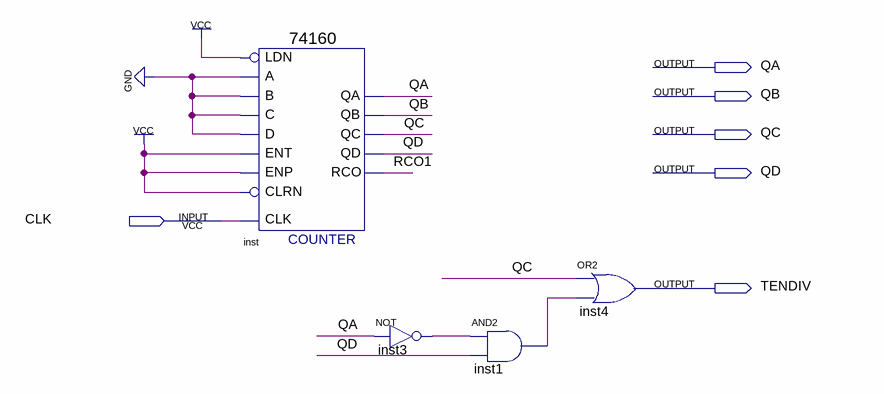
[diagram p0: schematic sheet]
// Quartus schematic 10FENPING.bdf as structural Verilog: 4 symbols, 6 pins
module \10FENPING  (
  input  CLK,
  output QA,
  output QB,
  output QC,
  output QD,
  output TENDIV
);

  wire inst1_out, inst3_out, RCO1;

  \74160  inst (
    .CLK(CLK), .ENT(1'b1), .A(1'b0), .B(1'b0), .C(1'b0), .D(1'b0), .LDN(1'b1), .ENP(1'b1), .CLRN(1'b1),
    .QD(QD), .QA(QA), .QB(QB), .QC(QC), .RCO(RCO1));
  not inst3 (inst3_out, QA);
  and inst1 (inst1_out, inst3_out, QD);
  or inst4 (TENDIV, QC, inst1_out);
endmodule
